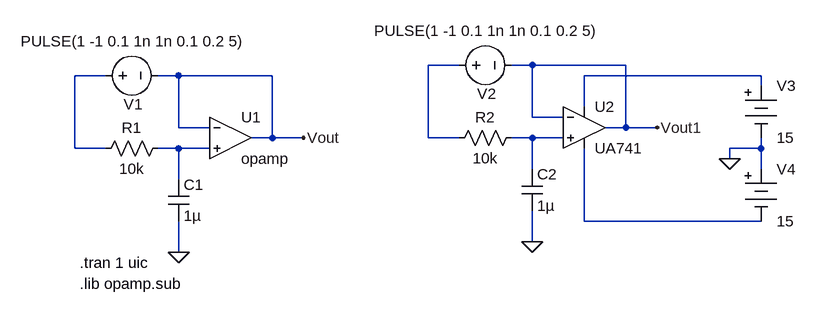
[diagram p0: schematic g3_p25.asc]
g3_p25.asc, the LTspice schematic file:
Version 4
SHEET 1 1032 680
WIRE 512 32 464 32
WIRE 624 32 592 32
WIRE 768 32 624 32
WIRE -32 48 -80 48
WIRE 80 48 48 48
WIRE 224 48 80 48
WIRE 976 48 704 48
WIRE 976 64 976 48
WIRE 704 96 704 48
WIRE 624 112 624 32
WIRE 672 112 624 112
WIRE 80 128 80 48
WIRE 128 128 80 128
WIRE 768 128 768 32
WIRE 768 128 736 128
WIRE 816 128 768 128
WIRE 224 144 224 48
WIRE 224 144 192 144
WIRE 272 144 224 144
WIRE 464 144 464 32
WIRE 512 144 464 144
WIRE 624 144 592 144
WIRE 672 144 624 144
WIRE -80 160 -80 48
WIRE -32 160 -80 160
WIRE 80 160 48 160
WIRE 128 160 80 160
WIRE 976 160 976 144
WIRE 976 160 928 160
WIRE 928 176 928 160
WIRE 624 192 624 144
WIRE 976 192 976 160
WIRE 80 208 80 160
WIRE 704 272 704 160
WIRE 976 272 704 272
WIRE 80 320 80 272
WIRE 624 304 624 256
FLAG 80 320 0
FLAG 272 144 Vout
FLAG 624 304 0
FLAG 816 128 Vout1
FLAG 928 176 0
SYMBOL Opamps\\opamp 160 80 R0
SYMATTR InstName U1
SYMBOL cap 64 208 R0
SYMATTR InstName C1
SYMATTR Value 1µ
SYMBOL res 64 144 R90
WINDOW 0 0 56 VBottom 2
WINDOW 3 32 56 VTop 2
SYMATTR InstName R1
SYMATTR Value 10k
SYMBOL voltage -48 48 R270
WINDOW 0 -60 58 VTop 2
WINDOW 3 37 58 VTop 2
WINDOW 123 0 0 Left 0
WINDOW 39 0 0 Left 0
SYMATTR InstName V1
SYMATTR Value PULSE(1 -1 0.1 1n 1n 0.1 0.2 5)
SYMBOL cap 608 192 R0
SYMATTR InstName C2
SYMATTR Value 1µ
SYMBOL res 608 128 R90
WINDOW 0 0 56 VBottom 2
WINDOW 3 32 56 VTop 2
SYMATTR InstName R2
SYMATTR Value 10k
SYMBOL voltage 496 32 R270
WINDOW 0 -60 58 VTop 2
WINDOW 3 37 58 VTop 2
WINDOW 123 0 0 Left 0
WINDOW 39 0 0 Left 0
SYMATTR InstName V2
SYMATTR Value PULSE(1 -1 0.1 1n 1n 0.1 0.2 5)
SYMBOL AutoGenerated\\UA741 704 128 R0
SYMATTR InstName U2
SYMBOL Misc\\battery 976 48 R0
WINDOW 123 0 0 Left 0
WINDOW 39 0 0 Left 0
SYMATTR InstName V3
SYMATTR Value 15
SYMBOL Misc\\battery 976 176 R0
SYMATTR InstName V4
SYMATTR Value 15
TEXT -72 336 Left 2 !.tran 1 uic
TEXT -72 368 Left 2 !.lib opamp.sub

The netlist it stands for:
* g3_p25.asc
XU1 Vout N005 Vout opamp Aol=100K GBW=10Meg  ; pins invin noninvin out
C1 N005 0 1µ
R1 N005 N002 10k
V1 N002 Vout PULSE(1 -1 0.1 1n 1n 0.1 0.2 5)
C2 N004 0 1µ
R2 N004 N001 10k
V2 N001 Vout1 PULSE(1 -1 0.1 1n 1n 0.1 0.2 5)
* U2: UA741 (symbol AutoGenerated\UA741 not available, pins judged from their places): In+=N004 In-=Vout1 V+=N003 V-=N006 OUT=Vout1
V3 N003 0 15
V4 0 N006 15
.tran 1 uic
.lib opamp.sub
.backanno
.end